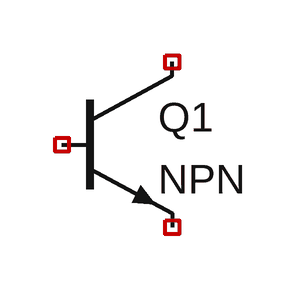
[diagram p0: schematic 37#24.5_1.(1).asc]
37#24.5_1.(1).asc, the LTspice schematic file:
Version 4
SHEET 1 880 680
SYMBOL npn 128 112 R0
SYMATTR InstName Q1

The netlist it stands for:
* 37#24.5_1.(1).asc
Q1 NC_01 NC_02 NC_03 0 NPN
.model NPN NPN
.model PNP PNP
.lib standard.bjt
.backanno
.end